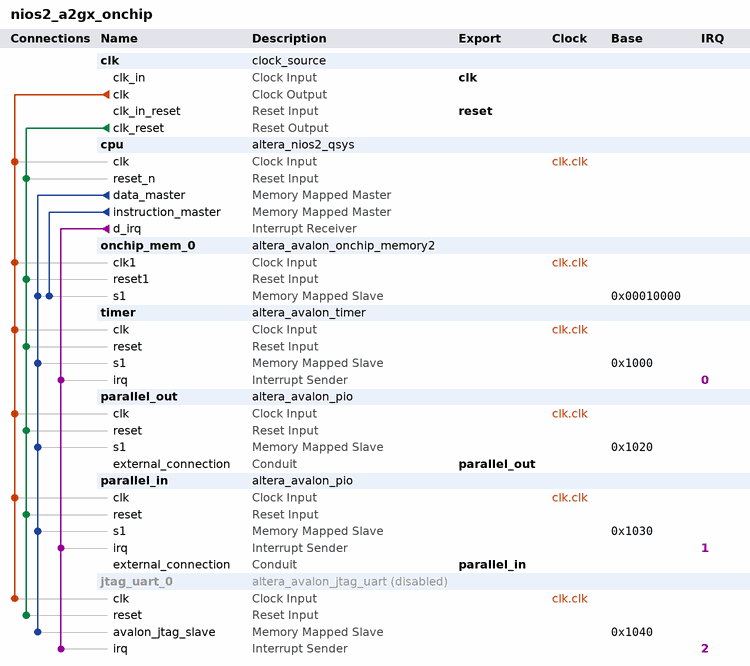
[diagram p0: system contents]
# Platform Designer (Qsys) system nios2_a2gx_onchip
# Parameters at their usual value, and those the tool derives, are not listed.
package require -exact qsys 11.0
create_system nios2_a2gx_onchip
set_project_property DEVICE_FAMILY ARRIAII

add_instance clk clock_source 11.0
set_instance_parameter_value clk clockFrequency 100000000

add_instance cpu altera_nios2_qsys 11.0
set_instance_parameter_value cpu muldiv_divider true
set_instance_parameter_value cpu manuallyAssignCpuID false
set_instance_parameter_value cpu resetSlave onchip_mem_0.s1
set_instance_parameter_value cpu exceptionSlave onchip_mem_0.s1
set_instance_parameter_value cpu breakSlave onchip_mem_0.s1
set_instance_parameter_value cpu muldiv_multiplierType DSPBlock
set_instance_parameter_value cpu impl Fast
set_instance_parameter_value cpu icache_size 4096
set_instance_parameter_value cpu icache_burstType Sequential
set_instance_parameter_value cpu dcache_bursts true
set_instance_parameter_value cpu debug_level NoDebug

add_instance onchip_mem_0 altera_avalon_onchip_memory2 11.0
set_instance_parameter_value onchip_mem_0 dataWidth 32
set_instance_parameter_value onchip_mem_0 dualPort false
set_instance_parameter_value onchip_mem_0 initMemContent true
set_instance_parameter_value onchip_mem_0 initializationFileName onchip_memory2_0
set_instance_parameter_value onchip_mem_0 memorySize 32768
set_instance_parameter_value onchip_mem_0 useNonDefaultInitFile true

add_instance timer altera_avalon_timer 11.0
set_instance_parameter_value timer period 1
set_instance_parameter_value timer periodUnits MSEC
set_instance_parameter_value timer timerPreset CUSTOM

add_instance parallel_out altera_avalon_pio 11.0
set_instance_parameter_value parallel_out direction Output
set_instance_parameter_value parallel_out width 32

add_instance parallel_in altera_avalon_pio 11.0
set_instance_parameter_value parallel_in direction Input
set_instance_parameter_value parallel_in generateIRQ true
set_instance_parameter_value parallel_in width 32

add_instance jtag_uart_0 altera_avalon_jtag_uart 11.0
set_instance_property jtag_uart_0 ENABLED false
set_instance_parameter_value jtag_uart_0 simInteractiveOptions INTERACTIVE_ASCII_OUTPUT

# connections
add_connection clk.clk cpu.clk clock
add_connection clk.clk jtag_uart_0.clk clock
add_connection clk.clk onchip_mem_0.clk1 clock
add_connection clk.clk parallel_in.clk clock
add_connection clk.clk parallel_out.clk clock
add_connection clk.clk timer.clk clock
add_connection clk.clk_reset cpu.reset_n reset
add_connection clk.clk_reset jtag_uart_0.reset reset
add_connection clk.clk_reset onchip_mem_0.reset1 reset
add_connection clk.clk_reset parallel_in.reset reset
add_connection clk.clk_reset parallel_out.reset reset
add_connection clk.clk_reset timer.reset reset
add_connection cpu.data_master jtag_uart_0.avalon_jtag_slave avalon
set_connection_parameter_value cpu.data_master/jtag_uart_0.avalon_jtag_slave baseAddress 0x1040
add_connection cpu.data_master onchip_mem_0.s1 avalon
set_connection_parameter_value cpu.data_master/onchip_mem_0.s1 baseAddress 0x00010000
add_connection cpu.data_master parallel_in.s1 avalon
set_connection_parameter_value cpu.data_master/parallel_in.s1 baseAddress 0x1030
add_connection cpu.data_master parallel_out.s1 avalon
set_connection_parameter_value cpu.data_master/parallel_out.s1 baseAddress 0x1020
add_connection cpu.data_master timer.s1 avalon
set_connection_parameter_value cpu.data_master/timer.s1 baseAddress 0x1000
add_connection cpu.instruction_master onchip_mem_0.s1 avalon
set_connection_parameter_value cpu.instruction_master/onchip_mem_0.s1 baseAddress 0x00010000
add_connection cpu.d_irq jtag_uart_0.irq interrupt
set_connection_parameter_value cpu.d_irq/jtag_uart_0.irq irqNumber 2
add_connection cpu.d_irq parallel_in.irq interrupt
set_connection_parameter_value cpu.d_irq/parallel_in.irq irqNumber 1
add_connection cpu.d_irq timer.irq interrupt
set_connection_parameter_value cpu.d_irq/timer.irq irqNumber 0

# exported interfaces
add_interface clk clock sink
set_interface_property clk EXPORT_OF clk.clk_in
add_interface reset reset sink
set_interface_property reset EXPORT_OF clk.clk_in_reset
add_interface parallel_out conduit end
set_interface_property parallel_out EXPORT_OF parallel_out.external_connection
add_interface parallel_in conduit end
set_interface_property parallel_in EXPORT_OF parallel_in.external_connection

save_system nios2_a2gx_onchip.qsys
